# Altium schematic sheet cc2520_cc2592.SchDoc: Edison Breakout
size Letter; Author: Ye-Sheng Kuo; Revision: 1; SheetTotal: 9
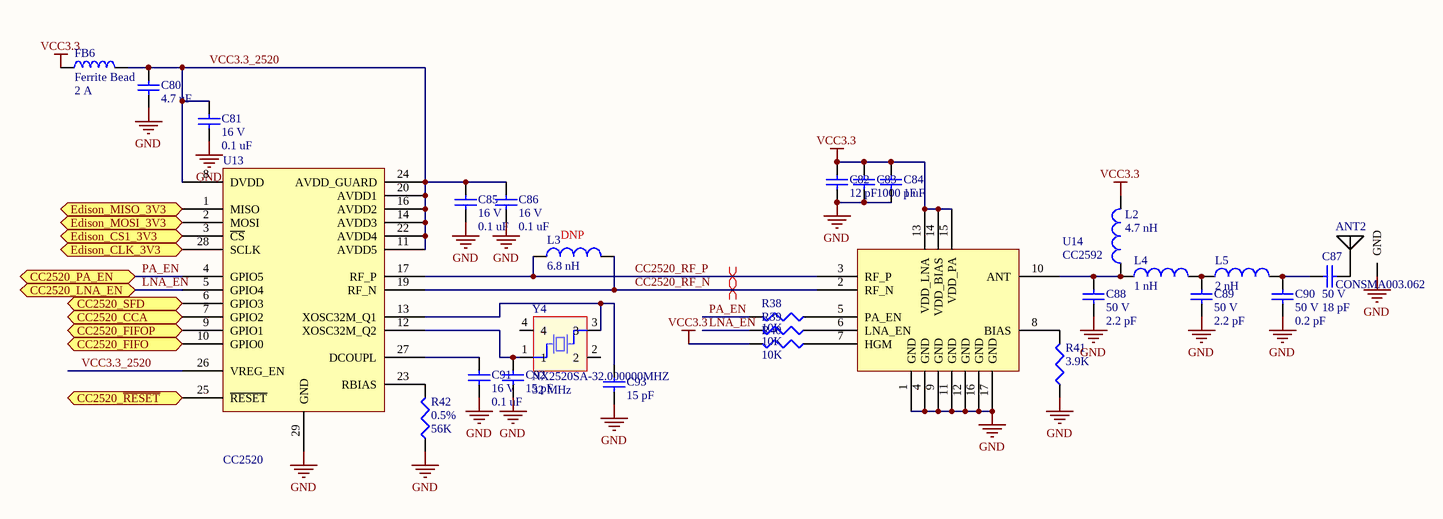
[diagram p0: cc2520_cc2592.SchDoc]

## Parts
ANT2  CONSMA003.062  [CONSMA003.062]
C80  value 4.7 uF  [0603]  (hidden comment: Ceramic capacitor)
C81  value 0.1 uF  voltage rated: 16 V  [0402]  (hidden comment: Ceramic capacitor)
C82  value 12 pF  [0402]  (hidden comment: Ceramic capacitor)
C83  value 1000 pF  [0402]  (hidden comment: Ceramic capacitor)
C84  value 1 uF  [0402]  (hidden comment: Ceramic capacitor)
C85  value 0.1 uF  voltage rated: 16 V  [0402]  (hidden comment: Ceramic capacitor)
C86  value 0.1 uF  voltage rated: 16 V  [0402]  (hidden comment: Ceramic capacitor)
C87  value 18 pF  voltage rated: 50 V  [0402]  (hidden comment: Ceramic capacitor)
C88  value 2.2 pF  voltage rated: 50 V  [0402]  (hidden comment: Ceramic capacitor)
C89  value 2.2 pF  voltage rated: 50 V  [0402]  (hidden comment: Ceramic capacitor)
C90  value 0.2 pF  voltage rated: 50 V  [0402]  (hidden comment: Ceramic capacitor)
C91  value 0.1 uF  voltage rated: 16 V  [0402]  (hidden comment: Ceramic capacitor)
C92  value 15 pF  [0402]  (hidden comment: Ceramic capacitor)
C93  value 15 pF  [0402]  (hidden comment: Ceramic capacitor)
FB6  Ferrite Bead  current rating: 2 A  [0603]
L2  value 4.7 nH  [0402]  (hidden comment: Chip inductor)
L3  value 6.8 nH  [0402]  (hidden comment: Chip inductor)
L4  value 1 nH  [0402]  (hidden comment: Chip inductor)
L5  value 2 nH  [0402]  (hidden comment: Chip inductor)
R38  value 10K  [0402]  (hidden comment: Chip resistor)
R39  value 10K  [0402]  (hidden comment: Chip resistor)
R40  value 10K  [0402]  (hidden comment: Chip resistor)
R41  value 3.9K  [0402]  (hidden comment: Chip resistor)
R42  value 56K  tolerance: 0.5%  [0402]  (hidden comment: Chip resistor)
U13  CC2520  [QFN-28]
U14  CC2592  [QFN-16]
Y4  NX2520SA-32.000000MHZ  Frequency: 32 MHz  [NX2520SA]

## Ports
CC2520_CCA, CC2520_FIFO, CC2520_FIFOP, CC2520_LNA_EN, CC2520_PA_EN, CC2520_SFD, CC2520_~{RESET}, Edison_CLK_3V3, Edison_CS1_3V3, Edison_MISO_3V3, Edison_MOSI_3V3

## Nets
GND: ANT2.1(GND) C80.2 C81.2 C82.2 C83.2 C84.2 C85.2 C86.2 C88.2 C89.2 C90.2 C91.2 C92.2 C93.2 R41.2 R42.2 U13.29(GND) U14.1(GND) U14.4(GND) U14.9(GND) U14.11(GND) U14.12(GND) U14.16(GND) U14.17(GND)
VCC3.3: C82.1 C83.1 C84.1 FB6.2 L2.1 R40.1 U14.13(VDD_LNA) U14.14(VDD_BIAS) U14.15(VDD_PA)
CC2520_CCA: U13.7(GPIO2) ; port CC2520_CCA
CC2520_FIFO: U13.10(GPIO0) ; port CC2520_FIFO
CC2520_FIFOP: U13.9(GPIO1) ; port CC2520_FIFOP
CC2520_~{RESET}: U13.25(~{RESET}) ; port CC2520_~{RESET}
CC2520_RF_N: L3.1 U13.19(RF_N) U14.2(RF_N)
CC2520_RF_P: L3.2 U13.17(RF_P) U14.3(RF_P)
CC2520_SFD: U13.6(GPIO3) ; port CC2520_SFD
Edison_CLK_3V3: U13.28(SCLK) ; port Edison_CLK_3V3
Edison_CS1_3V3: U13.3(~{CS}) ; port Edison_CS1_3V3
Edison_MISO_3V3: U13.1(MISO) ; port Edison_MISO_3V3
Edison_MOSI_3V3: U13.2(MOSI) ; port Edison_MOSI_3V3
LNA_EN: R39.1 U13.5(GPIO4) ; port CC2520_LNA_EN
PA_EN: R38.1 U13.4(GPIO5) ; port CC2520_PA_EN
VCC3.3_2520: C80.1 C81.1 C85.1 C86.1 FB6.1 U13.8(DVDD) U13.11(AVDD5) U13.14(AVDD3) U13.16(AVDD2) U13.20(AVDD1) U13.22(AVDD4) U13.24(AVDD_GUARD) U13.26(VREG_EN)
NetANT2_2: ANT2.2 C87.2
NetC87_1: C87.1 C90.1 L5.1
NetC88_1: C88.1 L2.2 L4.2 U14.10(ANT)
NetC89_1: C89.1 L4.1 L5.2
NetC91_1: C91.1 U13.27(DCOUPL)
NetC92_1: C92.1 U13.12(XOSC32M_Q2) Y4.1
NetC93_1: C93.1 U13.13(XOSC32M_Q1) Y4.3
NetR38_2: R38.2 U14.5(PA_EN)
NetR39_2: R39.2 U14.6(LNA_EN)
NetR40_2: R40.2 U14.7(HGM)
NetR41_1: R41.1 U14.8(BIAS)
NetR42_1: R42.1 U13.23(RBIAS)

Not connected (* = marked no-connect by the designer): Y4 2 4

## Layout directives
differential pair: CC2520_RF_N, CC2520_RF_P

## Notes on the sheet
- (near L3) DNP
- Title
- Date:
- Author:
- Revision:
- Sheet
- of
- University of Michigan
- File:

## Library data of the parts
ANT2 = CONSMA003.062: CONN SMA JACK 50 OHM EDGE MNT; Supplier 1: Digi-Key; Supplier Part Number 1: CONSMA003.062-ND
C80 = C_4.7u_10V_0603_ceramic: Ceramic capacitor, 4.7u, 10V, 0603 package; Manufacture: TDK; tolerance: 20%; Temp rating: X5R; package: 0603; voltage rated: 10 V; Supplier 1: Digi-Key; Supplier Part Number 1: 445-7482-1-ND
C81 C85 C86 C91 = C_0.1u_16V_0402_ceramic: Ceramic capacitor, 0.1u, 16 V, 0402 package; Manufacture: Murata; tolerance: 10%; Temperature Coef: X7R; package: 0402; Supplier 1: Digi-Key; Supplier Part Number 1: 490-3261-1-ND
C82 = C_12p_0402_ceramic: Ceramic capacitor, 12 pF, 0402 package; Manufacture: Johanson; voltage rated: 50 V; tolerance: 2%; package: 0402; Supplier 1: Digi-Key; Supplier Part Number 1: 712-1256-1-ND
C83 = C_1000p_50V_0402_ceramic: Ceramic capacitor, 1000 pF, 0402 package; Manufacture: TDK; voltage rated: 50 V; tolerance: 10%; package: 0402; Supplier 1: Digi-Key; Supplier Part Number 1: 445-6846-1-ND
C84 = C_1u_16V_0402_ceramic: Ceramic capacitor, 1 uF, 16V, 0402 package; Manufacture: TDK; tolerance: 10%; Temperature rating: X5R; voltage rated: 16 V; package: 0402; Supplier 1: Digi-Key; Supplier Part Number 1: 445-4978-1-ND
C87 = C_18p_50V_0402_ceramic: Ceramic capacitor, 18 pF, 0402 package; Manufacture: Johanson; tolerance: 2%; Temperature Coefficient: C0G; package: 0402; Supplier 1: Digi-Key; Supplier Part Number 1: 712-1264-1-ND
C88 C89 = C_2.2p_50V_0402_ceramic: Ceramic capacitor, 2.2 pF, 0402 package; Manufacture: Johanson; tolerance: 0.1 pF; Temperature Coefficient: C0G; package: 0402; Supplier 1: Digi-Key; Supplier Part Number 1: 712-1279-1-ND
C90 = C_0.2p_50V_0402_ceramic: Ceramic capacitor, 0.2 pF, 0402 package; Manufacture: Johanson; tolerance: 0.05 pF; Temperature Coefficient: C0G; package: 0402; Supplier 1: Digi-Key; Supplier Part Number 1: 712-1244-1-ND
C92 C93 = C_15p_25V_0402_ceramic: Ceramic capacitor, 15 pF, 25V, 0402 package; Manufacture: Murata; tolerance: 5%; voltage rated: 25 V; package: 0402; Supplier 1: Digi-Key; Supplier Part Number 1: 490-8171-1-ND
FB6 = FB_2A_0603: Ferrite Bead, 2 A, 0603 package; DC resistance: 50 m; package: 0603; Supplier 1: Digi-Key; Supplier Part Number 1: 553-2387-1-ND
L2 = L_4.7n_300mA_0402: Chip inductor, 4.7 nH, 0402 package, 300 mA; tolerance: 0.3 nH; Current Rating: 300 mA; package: 0402; Supplier 1: Digi-Key; Supplier Part Number 1: 490-2618-1-ND
L3 = L_6.8n_0402: Chip inductor, 6.8 nH, 0402 package; tolerance: 5%; package: 0402; Supplier 1: Digi-Key; Supplier Part Number 1: 712-1419-1-ND
L4 = L_1n_300mA_0402: Chip inductor, 1 nH, 0402 package, 300 mA; tolerance: 0.3 nH; Current Rating: 300 mA; package: 0402; Supplier 1: Digi-Key; Supplier Part Number 1: 490-1073-1-ND
L5 = L_2n_300mA_0402: Chip inductor, 2 nH, 0402 package, 300 mA; tolerance: 0.3 nH; Current Rating: 300 mA; package: 0402; Supplier 1: Digi-Key; Supplier Part Number 1: 490-6558-1-ND
R38-R40 = R_10K_0402: Chip resistor, 10K, 0402 package; tolerance: 1%; power: 1/16 W; package: 0402; Supplier 1: Digi-Key; Supplier Part Number 1: 541-10.0KLCT-ND
R41 = R_3.9K_0402: Chip resistor, 3.9K, 0402 package; tolerance: 1%; power: 1/16 W; package: 0402; Supplier 1: Digi-Key; Supplier Part Number 1: 311-3.90KLRCT-ND
R42 = R_56K_0402: Chip resistor, 56K, 0402 package; power: 1/16 W; Temperature coefficient: 25 ppm/C; package: 0402; Supplier 1: Digi-Key; Supplier Part Number 1: P56KDECT-ND
U13 = CC2520: 2.4 GHZ IEEE 802.15.4/ZIGBEE® RF TRANSCEIVER; Supplier 1: Digi-Key; Supplier Part Number 1: 296-22996-6-ND
U14 = CC2592: 2.4-GHz Range Extender; Supplier 1: Digi-Key; Supplier Part Number 1: 296-37475-1-ND
Y4 = NX2520SA-32.000000MHZ: Crystal 32.0000MHz 10ppm 10pF 50 Ohm; ESR: 50 ohm; Load capacitance: 10 pF; Frequency stability: 10 ppm; Frequency tolerance: 10 ppm; Supplier 1: Digi-Key; Supplier Part Number 1: 644-1065-1-ND